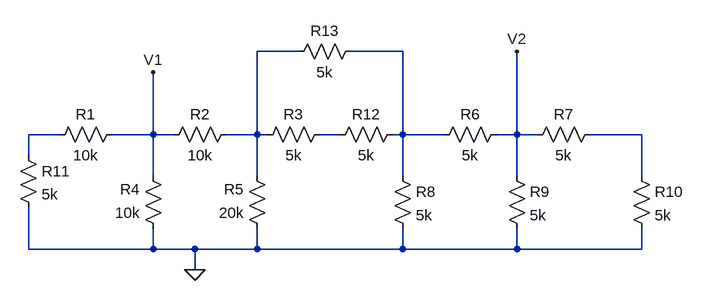
[diagram p0: schematic CircuitoPrueba2.asc]
CircuitoPrueba2.asc, the LTspice schematic file:
Version 4
SHEET 1 1040 680
WIRE 416 -32 352 -32
WIRE 576 -32 496 -32
WIRE 48 96 0 96
WIRE 192 96 192 0
WIRE 192 96 128 96
WIRE 224 96 192 96
WIRE 352 96 352 -32
WIRE 352 96 304 96
WIRE 368 96 352 96
WIRE 480 96 448 96
WIRE 576 96 576 -32
WIRE 576 96 560 96
WIRE 640 96 576 96
WIRE 752 96 752 -32
WIRE 752 96 720 96
WIRE 784 96 752 96
WIRE 944 96 864 96
WIRE 0 128 0 96
WIRE 192 160 192 96
WIRE 352 160 352 96
WIRE 576 160 576 96
WIRE 752 160 752 96
WIRE 944 160 944 96
WIRE 0 272 0 208
WIRE 192 272 192 240
WIRE 192 272 0 272
WIRE 256 272 192 272
WIRE 352 272 352 240
WIRE 352 272 256 272
WIRE 576 272 576 240
WIRE 576 272 352 272
WIRE 752 272 752 240
WIRE 752 272 576 272
WIRE 944 272 944 240
WIRE 944 272 752 272
WIRE 256 304 256 272
FLAG 256 304 0
FLAG 192 0 V1
FLAG 752 -32 V2
SYMBOL res 144 80 R90
WINDOW 0 0 56 VBottom 2
WINDOW 3 32 56 VTop 2
SYMATTR InstName R1
SYMATTR Value 10k
SYMBOL res 320 80 R90
WINDOW 0 0 56 VBottom 2
WINDOW 3 32 56 VTop 2
SYMATTR InstName R2
SYMATTR Value 10k
SYMBOL res 208 256 R180
WINDOW 0 36 76 Left 2
WINDOW 3 36 40 Left 2
SYMATTR InstName R4
SYMATTR Value 10k
SYMBOL res 368 256 R180
WINDOW 0 36 76 Left 2
WINDOW 3 36 40 Left 2
SYMATTR InstName R5
SYMATTR Value 20k
SYMBOL res 624 112 R270
WINDOW 0 32 56 VTop 2
WINDOW 3 0 56 VBottom 2
SYMATTR InstName R6
SYMATTR Value 5k
SYMBOL res 768 112 R270
WINDOW 0 32 56 VTop 2
WINDOW 3 0 56 VBottom 2
SYMATTR InstName R7
SYMATTR Value 5k
SYMBOL res 560 144 R0
SYMATTR InstName R8
SYMATTR Value 5k
SYMBOL res 736 144 R0
SYMATTR InstName R9
SYMATTR Value 5k
SYMBOL res 928 144 R0
SYMATTR InstName R10
SYMATTR Value 5k
SYMBOL res -16 112 R0
SYMATTR InstName R11
SYMATTR Value 5k
SYMBOL res 464 80 R90
WINDOW 0 0 56 VBottom 2
WINDOW 3 32 56 VTop 2
SYMATTR InstName R3
SYMATTR Value 5k
SYMBOL res 576 80 R90
WINDOW 0 0 56 VBottom 2
WINDOW 3 32 56 VTop 2
SYMATTR InstName R12
SYMATTR Value 5k
SYMBOL res 512 -48 R90
WINDOW 0 0 56 VBottom 2
WINDOW 3 32 56 VTop 2
SYMATTR InstName R13
SYMATTR Value 5k

The netlist it stands for:
* CircuitoPrueba2.asc
R1 V1 N003 10k
R2 N001 V1 10k
R4 0 V1 10k
R5 0 N001 20k
R6 N002 V2 5k
R7 V2 N005 5k
R8 N002 0 5k
R9 V2 0 5k
R10 N005 0 5k
R11 N003 0 5k
R3 N004 N001 5k
R12 N002 N004 5k
R13 N002 N001 5k
.backanno
.end